# Altium schematic sheet Top Level.SchDoc
size A4; SheetNumber: 1; SheetTotal: 6
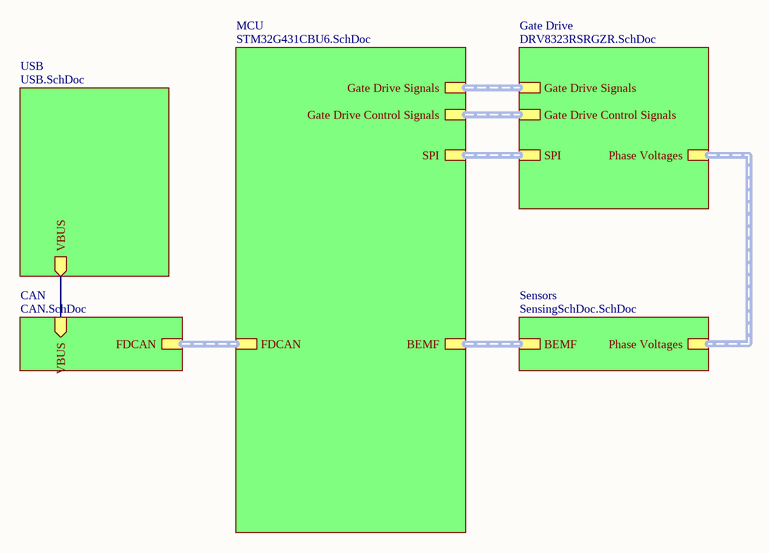
[diagram p0: Top Level.SchDoc]

## Sub-sheets
CAN = CAN.SchDoc: FDCAN, VBUS (in)
Gate Drive = DRV8323RSRGZR.SchDoc: Gate Drive Signals, SPI, Gate Drive Control Signals, Phase Voltages
MCU = STM32G431CBU6.SchDoc: Gate Drive Signals, SPI, Gate Drive Control Signals, BEMF, FDCAN
Sensors = SensingSchDoc.SchDoc: BEMF, Phase Voltages
USB = USB.SchDoc: VBUS (out)

## Nets
(unnamed): sheet CAN/VBUS, sheet USB/VBUS

## Buses and harness runs
harness sheet CAN/FDCAN = sheet MCU/FDCAN
harness sheet Gate Drive/Gate Drive Control Signals = sheet MCU/Gate Drive Control Signals
harness sheet Gate Drive/Gate Drive Signals = sheet MCU/Gate Drive Signals
harness sheet Gate Drive/Phase Voltages = sheet Sensors/Phase Voltages
harness sheet Gate Drive/SPI = sheet MCU/SPI
harness sheet MCU/BEMF = sheet Sensors/BEMF